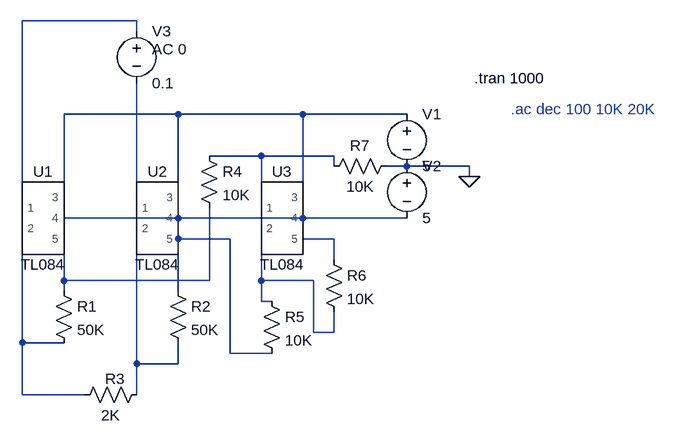
[diagram p0: schematic 实验一.asc]
实验一.asc, the LTspice schematic file:
Version 4
SHEET 1 1008 680
WIRE 192 -176 16 -176
WIRE 192 -160 192 -176
WIRE 256 -32 80 -32
WIRE 448 -32 256 -32
WIRE 608 -32 448 -32
WIRE 384 32 304 32
WIRE 496 32 384 32
WIRE 496 48 496 32
WIRE 608 48 576 48
WIRE 704 48 608 48
WIRE 704 64 704 48
WIRE 80 96 80 -32
WIRE 256 96 256 -32
WIRE 448 96 448 -32
WIRE 16 112 16 -176
WIRE 192 112 192 -80
WIRE 384 112 384 32
WIRE 256 128 80 128
WIRE 448 128 256 128
WIRE 608 128 448 128
WIRE 336 160 256 160
WIRE 496 160 448 160
WIRE 496 192 496 160
WIRE 80 224 80 160
WIRE 304 224 304 112
WIRE 304 224 80 224
WIRE 384 224 384 144
WIRE 464 224 384 224
WIRE 80 240 80 224
WIRE 256 240 256 160
WIRE 384 256 384 224
WIRE 400 256 384 256
WIRE 464 304 464 224
WIRE 496 304 496 272
WIRE 496 304 464 304
WIRE 16 320 16 144
WIRE 80 320 16 320
WIRE 336 336 336 160
WIRE 400 336 336 336
WIRE 192 352 192 144
WIRE 256 352 256 320
WIRE 256 352 192 352
WIRE 16 400 16 320
WIRE 112 400 16 400
WIRE 192 400 192 352
FLAG 704 64 0
SYMBOL TL084 48 128 R0
SYMATTR InstName U1
SYMBOL TL084 224 128 R0
SYMATTR InstName U2
SYMBOL TL084 416 128 R0
SYMATTR InstName U3
SYMBOL voltage 608 -48 R0
WINDOW 123 0 0 Left 0
WINDOW 39 0 0 Left 0
SYMATTR InstName V1
SYMATTR Value 5
SYMBOL voltage 608 32 R0
WINDOW 123 0 0 Left 0
WINDOW 39 0 0 Left 0
SYMATTR InstName V2
SYMATTR Value 5
SYMBOL res 64 224 R0
SYMATTR InstName R1
SYMATTR Value 50K
SYMBOL res 240 224 R0
SYMATTR InstName R2
SYMATTR Value 50K
SYMBOL res 208 384 R90
WINDOW 0 7 49 VBottom 2
WINDOW 3 32 56 VTop 2
SYMATTR InstName R3
SYMATTR Value 2K
SYMBOL res 288 16 R0
SYMATTR InstName R4
SYMATTR Value 10K
SYMBOL res 384 240 R0
SYMATTR InstName R5
SYMATTR Value 10K
SYMBOL res 480 176 R0
SYMATTR InstName R6
SYMATTR Value 10K
SYMBOL res 592 32 R90
WINDOW 0 0 56 VBottom 2
WINDOW 3 32 56 VTop 2
SYMATTR InstName R7
SYMATTR Value 10K
SYMBOL voltage 192 -176 R0
WINDOW 123 24 44 Left 2
WINDOW 39 0 0 Left 0
SYMATTR InstName V3
SYMATTR Value 0.1
SYMATTR Value2 AC 0
TEXT 712 -88 Left 2 !.tran 1000
TEXT 768 -40 Left 2 ;.ac dec 100 10K 20K

The netlist it stands for:
* 实验一.asc
XU1 N001 N010 N002 N005 N008 TL084  ; pins 1 2 3 4 5
XU2 N004 N011 N002 N005 N006 TL084  ; pins 1 2 3 4 5
XU3 N003 N009 N002 N005 N007 TL084  ; pins 1 2 3 4 5
V1 N002 0 5
V2 0 N005 5
R1 N008 N010 50K
R2 N006 N011 50K
R3 N011 N010 2K
R4 N003 N008 10K
R5 N009 N006 10K
R6 N007 N009 10K
R7 0 N003 10K
V3 N001 N004 0.1 AC 0
.tran 1000
* .ac dec 100 10K 20K
.lib C:\Users\Aristotle\Documents\LTspice\TL084.301
.backanno
.end